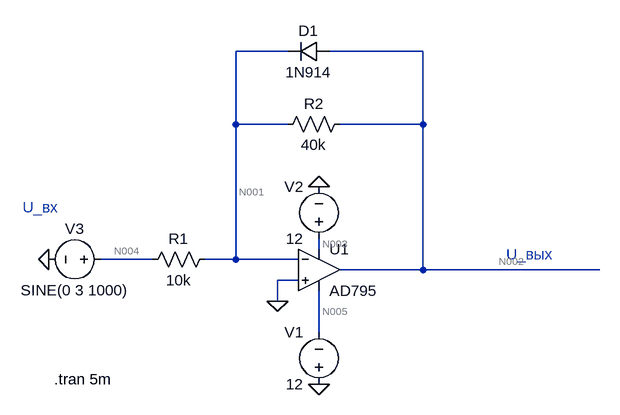
[diagram p0: schematic s1.asc]
s1.asc, the LTspice schematic file:
Version 4.1
SHEET 1 880 680
WIRE 192 -144 112 -144
WIRE 400 -144 256 -144
WIRE 112 -32 112 -144
WIRE 192 -32 112 -32
WIRE 400 -32 400 -144
WIRE 400 -32 272 -32
WIRE 240 160 240 144
WIRE -16 176 -96 176
WIRE 112 176 112 -32
WIRE 112 176 64 176
WIRE 208 176 112 176
WIRE 400 192 400 -32
WIRE 400 192 272 192
WIRE 672 192 400 192
WIRE 208 208 176 208
WIRE 176 240 176 208
WIRE 240 288 240 224
FLAG 176 240 0
FLAG 240 64 0
FLAG 240 368 0
FLAG -176 176 0
SYMBOL OpAmps\\AD795 240 128 R0
SYMATTR InstName U1
SYMBOL res 80 160 R90
WINDOW 0 0 56 VBottom 2
WINDOW 3 32 56 VTop 2
SYMATTR InstName R1
SYMATTR Value 10k
SYMBOL res 288 -48 R90
WINDOW 0 0 56 VBottom 2
WINDOW 3 32 56 VTop 2
SYMATTR InstName R2
SYMATTR Value 40k
SYMBOL voltage 240 384 R180
WINDOW 0 24 96 Left 2
WINDOW 3 24 16 Left 2
SYMATTR InstName V1
SYMATTR Value 12
SYMBOL voltage 240 160 R180
WINDOW 0 24 96 Left 2
WINDOW 3 24 16 Left 2
SYMATTR InstName V2
SYMATTR Value 12
SYMBOL voltage -80 176 R90
WINDOW 0 -32 56 VBottom 2
WINDOW 3 32 56 VTop 2
SYMATTR InstName V3
SYMATTR Value SINE(0 3 1000)
SYMBOL diode 256 -160 R90
WINDOW 0 0 32 VBottom 2
WINDOW 3 32 32 VTop 2
SYMATTR InstName D1
SYMATTR Value 1N914
TEXT -216 96 Left 2 ;U_вх
TEXT 528 168 Left 2 ;U_вых
TEXT -168 360 Left 2 !.tran 5m

The netlist it stands for:
* s1.asc
X§U1 0 N001 N003 N005 N002 AD795  ; pins In+ In- V+ V- OUT
R1 N001 N004 10k
R2 N002 N001 40k
V1 0 N005 12
V2 N003 0 12
V3 N004 0 SINE(0 3 1000)
D1 N002 N001 1N914
.model D D
.lib standard.dio
* U_вх
* U_вых
.tran 5m
.lib ADI1.lib
.backanno
.end

* Results of the author's LTspice run, read from the files saved beside the schematic
* Operating Point, zero values left out:
*   V(n003) = 12 V
*   V(n005) = -12 V
*   I(V1) = -1.226 mA
*   I(V2) = -1.226 mA
*   Ix(u1:3) = 1.226 mA
*   Ix(u1:4) = -1.226 mA
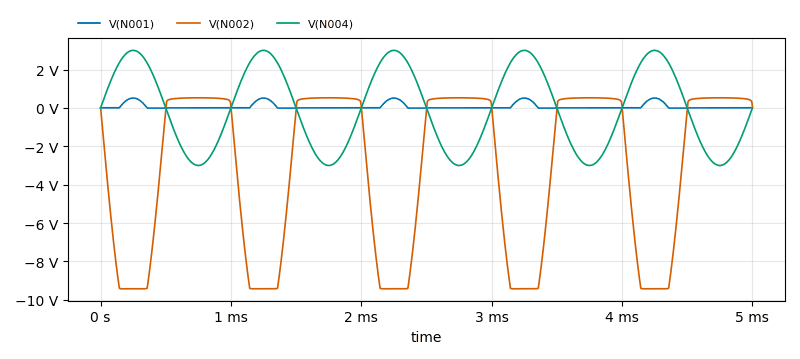
[diagram p1: Transient Analysis of s1.asc, plotted from the saved traces]
* Transient Analysis, 1 run:
*   V(N001): min -9.078 mV, max 514.7 mV, average 72.31 mV, rms 172.3 mV, last 8.942 mV
*   V(N002): min -9.428 V, max 527.7 mV, average -3.213 V, rms 5.344 V, last 56.68 mV
*   V(N004): min -3 V, max 3 V, average -11.03 µV, rms 2.121 V, last 0 V